# EAGLE design fuse-a-1 (EAGLE 9.6.2)
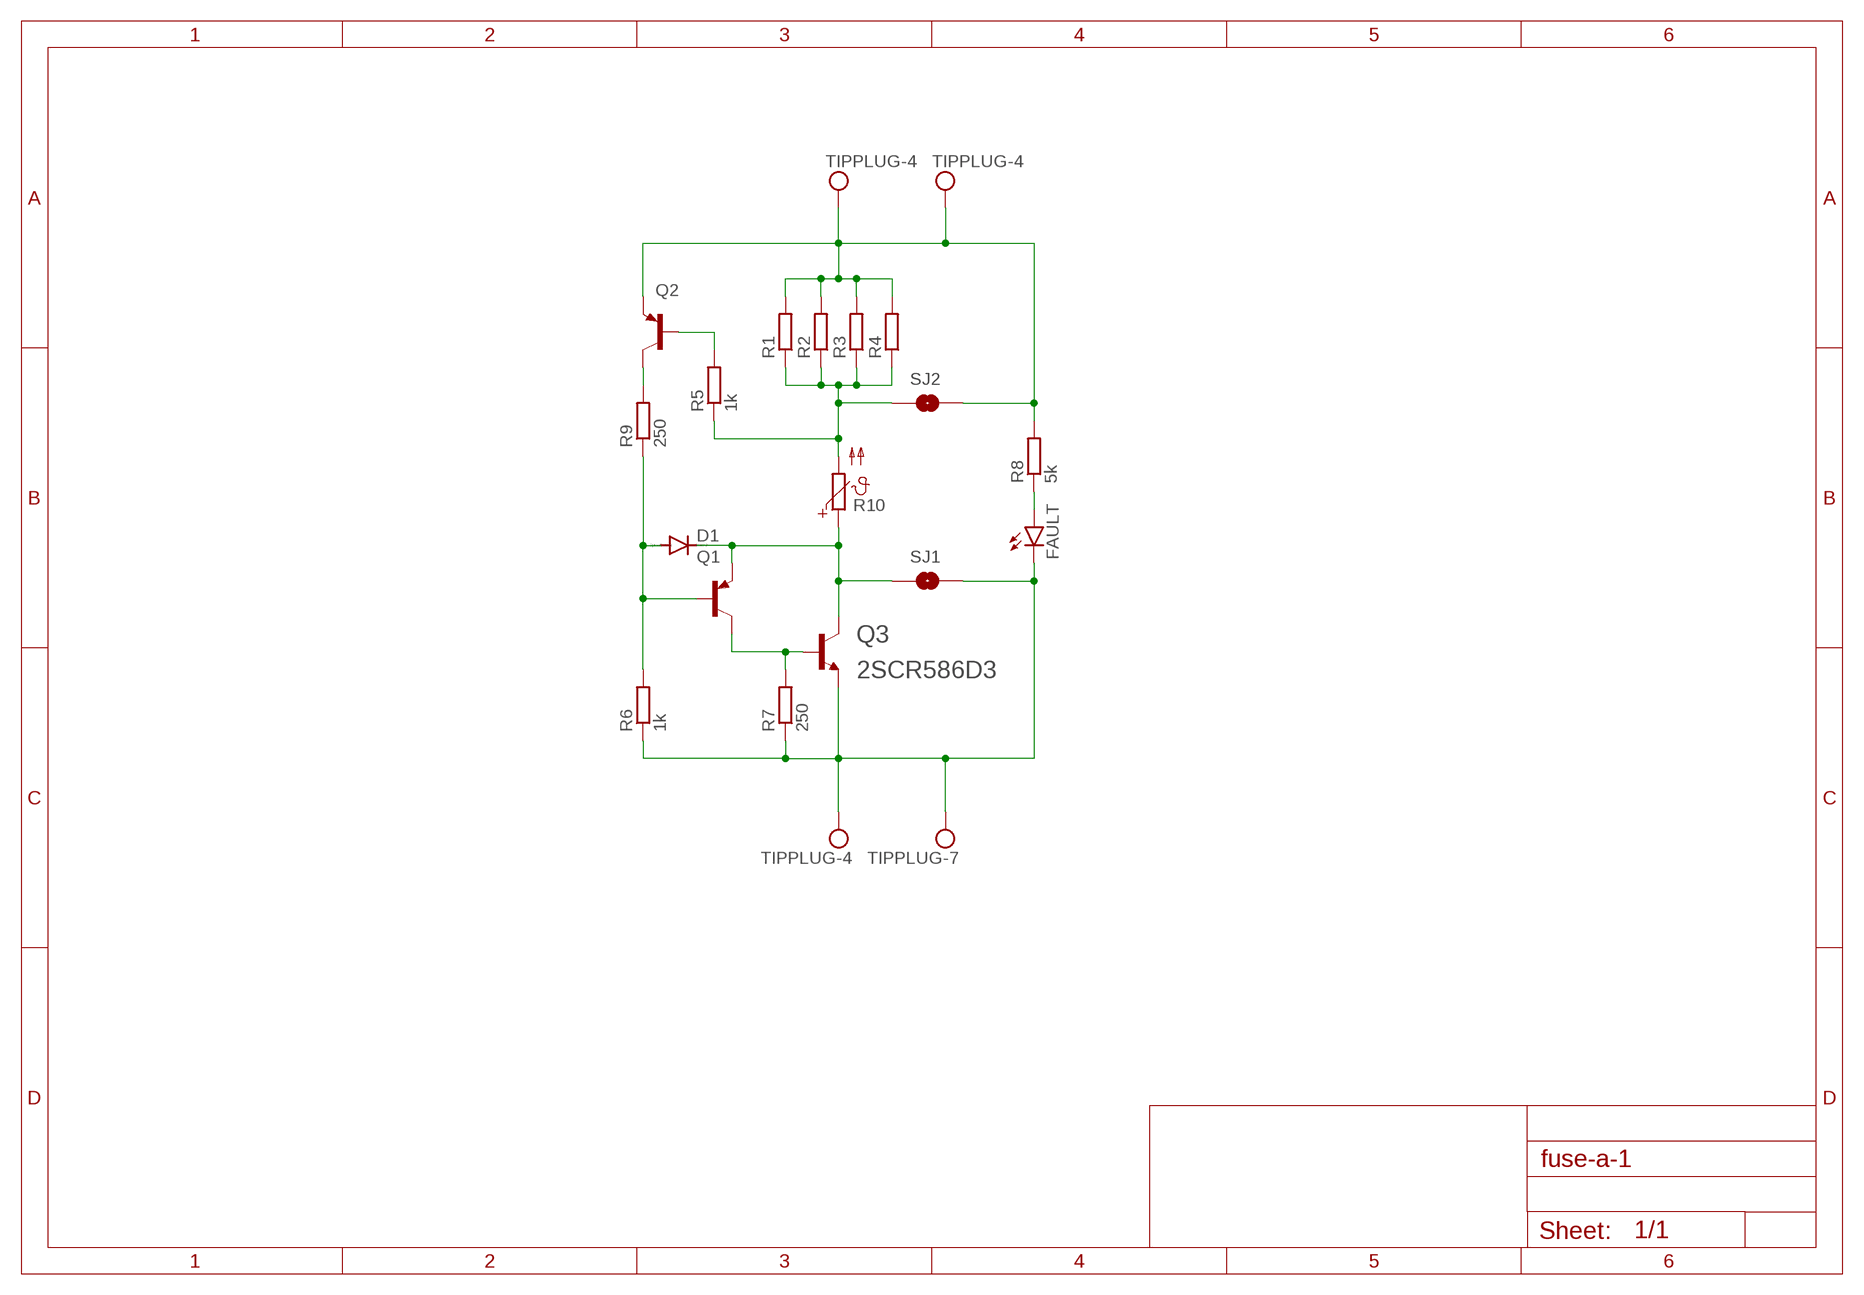
[diagram p0: schematic, sheet 1]

## Parts
D1  DIODE-MINIMELF  [MINIMELF]
FAULT  LEDCHIPLED_0603  [CHIPLED_0603]
Q1  BCX71SMD  [SOT23]
Q2  BCX71SMD  [SOT23]
Q3  2SCR586D3  2SCR586D3TL1  [D-PAK_TO252AA]
R1  R-EU_R2512  [R2512]
R2  R-EU_R2512  [R2512]
R3  R-EU_R2512  [R2512]
R4  R-EU_R2512  [R2512]
R5  1k  R-EU_R0805  [R0805]
R6  1k  R-EU_R0805  [R0805]
R7  250  R-EU_R0805  [R0805]
R8  5k  R-EU_R0805  [R0805]
R9  250  R-EU_R0805  [R0805]
R10  PTC_1812  [PTC1812]
SJ1  SJRND2  [SJ_RND2]
SJ2  SJRND2  [SJ_RND2]
U$1  TIPPLUG-4  [BANANAPLUG-4-LUG]
U$2  TIPPLUG-4  [BANANAPLUG-4-LUG]
U$3  TIPPLUG-7  [BANANAPLUG-7-LUG]
U$4  TIPPLUG-4  [BANANAPLUG-4-LUG]

## Nets
FUSEIN: R1.1 R2.1 R3.1 R4.1 R5.1 R10.2 SJ2.P$1
FUSEOUT: D1.C Q1.2(E) Q3.4(C) R10.1 SJ1.P$1
N$1: Q2.1(B) R5.2
N$4: D1.A Q1.1(B) R6.2 R9.1
N$5: Q1.3(C) Q3.1(B) R7.2
N$6: FAULT.A R8.1
N$8: Q2.3(C) R9.2
VIN: Q2.2(E) R1.2 R2.2 R3.2 R4.2 R8.2 SJ2.P$2 U$1.4MM($1) U$4.4MM($1)
VOUT: FAULT.C Q3.3(E) R6.1 R7.1 SJ1.P$2 U$2.4MM($1) U$3.7MM($1)

## Library data of the parts
D1 = diode:DIODE-: DIODE
FAULT = led:LED: LED OSRAM: - CHIPLED LG R971, LG N971, LY N971, LG Q971, LY Q971, LO R971, LY R971 LH N974, LH R974 LS Q976, LO Q976, LY Q976 LO Q996 - Hyper CHIPLED LW Q18S LB Q993, LB Q99A, LB R99A - SideLED LS A670, LO A670, LY A670, LG A670, LP A670 LB A673, LV A673, LT A673, LW A673 LH A674 LY A675 LS A676, LA A676, LO A676, LY A676, LW A676 LS A679, LY A679, LG A679 - Hyper Micro SIDELED® LS Y876, LA Y876, LO Y876, LY Y876 LT Y87S - SmartLED LW L88C, LW L88S LB L89C, LB L89S, LG L890 LS L89K, LO L89K, LY L89K LS L896, LA L896, LO L896, LY L896 - TOPLED LS T670, LO T670, LY T670, LG T670, LP T670 LSG T670, LSP T670, LSY T670, LOP T670, LYG T670 LG T671, LOG T671, LSG T671 LB T673, LV T673, LT T673, LW T673 LH T674 LS T676, LA T676, LO T676, LY T676, LB T676, LH T676, LSB T676, LW T676 LB T67C, LV T67C, LT T67C, LS T67K, LO T67K, LY T67K, LW E67C LS E67B, LA E67B, LO E67B, LY E67B, LB E67C, LV E67C, LT E67C LW T67C LS T679, LY T679, LG T679 LS T770, LO T770, LY T770, LG T770, LP T770 LB T773, LV T773, LT T773, LW T773 LH T774 LS E675, LA E675, LY E675, LS T675 LS T776, LA T776, LO T776, LY T776, LB T776 LHGB T686 LT T68C, LB T68C - Hyper Mini TOPLED® LB M676 - Mini TOPLED Santana® LG M470 LS M47K, LO M47K, LY M47K Source: http://www.osram.convergy.de LUXEON: - LUMILED® LXK2-PW12-R00, LXK2-PW12-S00, LXK2-PW14-U00, LXK2-PW14-V00 LXK2-PM12-R00, LXK2-PM12-S00, LXK2-PM14-U00 LXK2-PE12-Q00, LXK2-PE12-R00, LXK2-PE12-S00, LXK2-PE14-T00, LXK2-PE14-U00 LXK2-PB12-K00, LXK2-PB12-L00, LXK2-PB12-M00, LXK2-PB14-N00, LXK2-PB14-P00, LXK2-PB14-Q00 LXK2-PR12-L00, LXK2-PR12-M00, LXK2-PR14-Q00, LXK2-PR14-R00 LXK2-PD12-Q00, LXK2-PD12-R00, LXK2-PD12-S00 LXK2-PH12-R00, LXK2-PH12-S00 LXK2-PL12-P00, LXK2-PL12-Q00, LXK2-PL12-R00 Source: www.luxeon.com KINGBRIGHT: KA-3528ASYC Source: www.kingbright.com
Q1 Q2 = transistor-pnp:BCX71SMD: PNP Transistor
Q3 = eagleparts:2SCR586D3TL1
R1-R9 = rcl:R-EU_: RESISTOR, European symbol; SPICEPREFIX: R
R10 = tcs:PTC_: PHILIPS PTC
SJ1 SJ2 = eagleparts:SJ: SMD solder JUMPER
U$1-U$4 = eagleparts:TIPPLUG

## Board
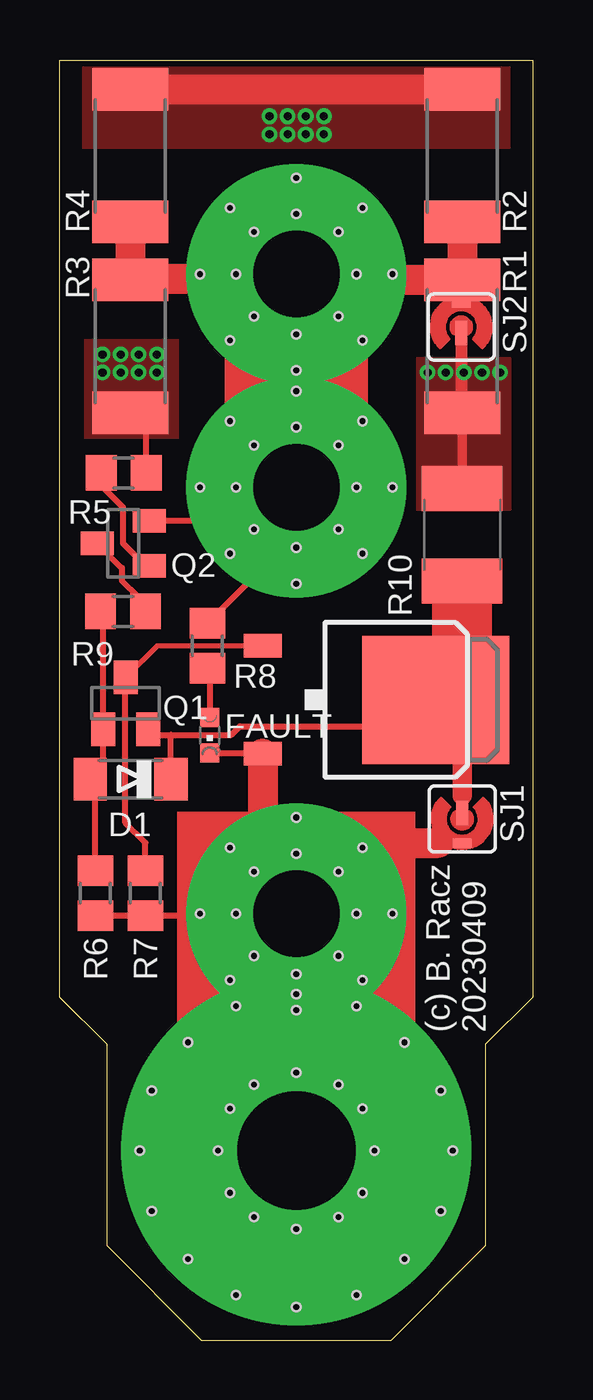
[diagram p1: board, top side]
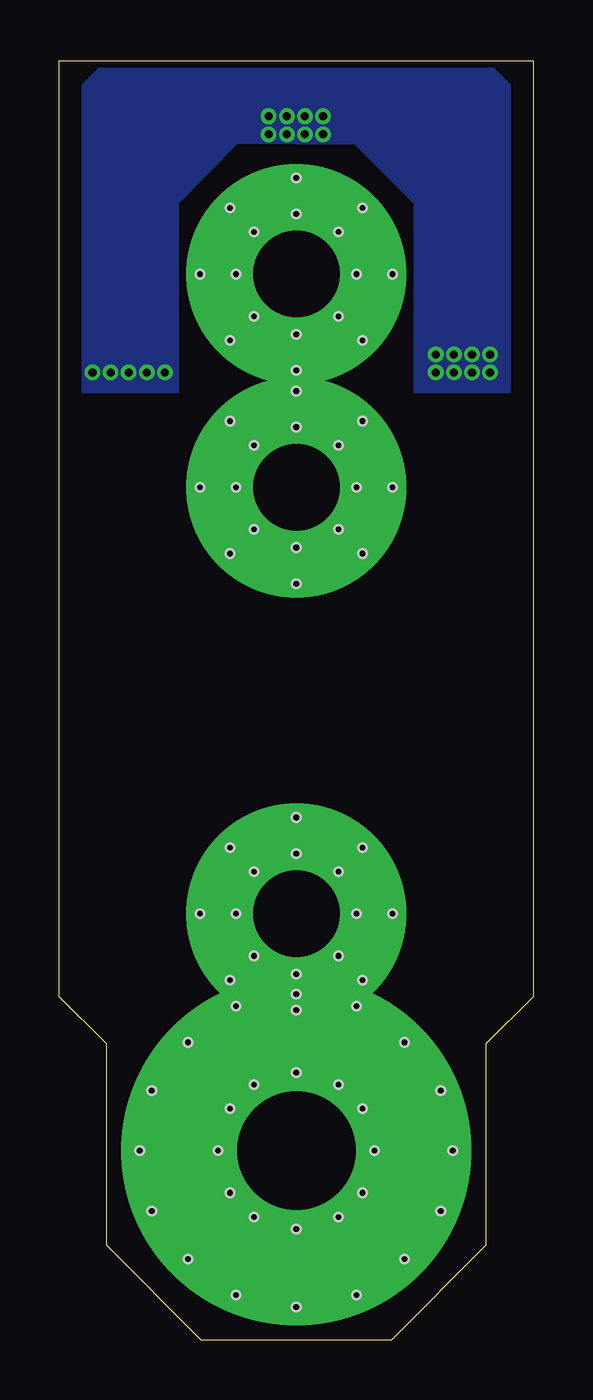
[diagram p2: board, bottom side, seen from below]

Size 20 x 54 mm. Coordinates in mm from the lower left corner, seen from the top.
Outline: 6,0 14,0 18,4 18,12.5 20,14.5 20,54 0,54 0,14.5 2,12.5 2,4 6,0
Copper layers (1*16): Top 0.035mm / dielectric 1.5mm / Bottom 0.035mm
Design rules "SeeedStudio_2layer_DRU_no_angle_20140221": minimum track width 6mil, minimum drill 12mil, track to track 6mil, track to pad 6mil, pad to pad 6mil, via to via 6mil, smd to smd 0mil, copper to edge 10mil, drill to drill 10mil, minimum pad ring 10mil, minimum via ring 6mil, stop-mask expansion 2mil, vias tented up to drill 100mil, thermal gap 10mil

### Footprints (pad centres in the part's own frame; a part is rotated, then mirrored left to right if it is on the bottom)
MINIMELF = smd 1.4 x 1.8: A 1.7,0; C -1.7,0
CHIPLED_0603 = smd 0.8 x 0.8: A 0,-0.75; C 0,0.75
SOT23 = smd 1 x 1.4: 1 -0.95,-1.1; 2 0.95,-1.1; 3 0,1.1
D-PAK_TO252AA = smd 1 x 1.6: 1 -2.28,-4.8; 3 2.28,-4.8 | smd 5.4 x 6.2: 4 0,2.5
R2512 = smd 1.8 x 3.2: 1 -2.8,0; 2 2.8,0
R0805 = smd 1.3 x 1.5: 1 -0.95,0; 2 0.95,0
PTC1812 = smd 1.9 x 3.4: 1 -1.95,0; 2 1.95,0
SJ_RND2 = smd 1.016 x 0.508: P$1 -0.254,0 | smd 0.406 x 0.813: P$2 1.016,0
BANANAPLUG-4-LUG = drill 3.65 pad 9.3: 4MM 0,0 | hole 0.35: 0,2.54; 0,-2.54; 2.54,0; -2.54,0; -1.778,1.778; 1.778,1.778; 1.778,-1.778; -1.778,-1.778; 0,4.064; 4.064,0; -4.064,0; 0,-4.064; 2.794,-2.794; -2.794,-2.794; -2.794,2.794; 2.794,2.794
BANANAPLUG-7-LUG = drill 5 pad 14.75: 7MM 0,0 | hole 0.35: 0,3.302; 0,-3.302; 3.302,0; -3.302,0; 1.778,2.794; 2.794,1.778; 2.794,-1.778; 1.778,-2.794; -1.778,-2.794; -2.794,-1.778; -2.794,1.778; -1.778,2.794; 0,6.604; 0,-6.604; 6.604,0; -6.604,0; 4.572,4.572; -4.572,-4.572; -4.572,4.572; 4.572,-4.572; 2.54,6.096; -2.54,6.096; -2.54,-6.096; 2.54,-6.096; 6.096,2.54; -6.096,2.54; -6.096,-2.54; 6.096,-2.54

### Placement (x,y rotation side)
D1  3.01,23.69 180 top
FAULT  6.35,25.54 180 top
Q1  2.8,26.89 0 top
Q2  2.7,33.64 90 top
Q3  13.38,27.03 270 top
R1  17,41.95 90 top
R2  17,50 270 top
R3  3,50 270 top
R4  3,41.95 90 top
R5  2.72,36.61 180 top
R6  1.53,18.87 90 top
R7  3.63,18.87 90 top
R8  6.25,29.31 90 top
R9  2.69,30.76 0 top
R10  17,34 90 top
SJ1  17,22 270 top
SJ2  16.96,42.77 90 top
U$1  10,36 90 top
U$2  10,18 270 top
U$3  10,8 90 top
U$4  10,45 270 top

### Tracks (layer width: path | path; a pad name or v marks a point on that pad's centre or on a via)
FUSEIN  (via drill 0.35)
  Top 0.254: R5.1 3.67,39.01 3.52,39.15 R4.1
  Top 0.406: R1.1 R10.2
  Top 0.508: SJ2.P$1 16.96,39.19 R1.1
  Top 1.27: R3.1 R2.1
  other vias: 15.54,40.84 16.31,40.84 17.07,40.84 17.83,40.84 18.59,40.84 8.88,50.9 9.64,50.9 10.4,50.9 11.16,50.9 8.88,51.67 9.64,51.67 10.4,51.67 11.16,51.67 1.83,40.84 2.59,40.84 3.35,40.84 4.11,40.84 4.11,41.61 3.35,41.61 2.59,41.61 1.83,41.61
  pour Top (no thermals): 15.09,35.05 19.05,35.05 19.05,41.45 15.09,41.45
  pour Top (no thermals): 19,50.33 19,54 1,54 1,50.33
  pour Bottom: 15,40 19,40 19,53 18.32,53.68 1.68,53.68 1,53 1,40 5,40 5,48 7.48,50.48 12.52,50.52 15,48
  pour Top (no thermals): 1.07,38.1 5.03,38.1 5.03,42.21 1.07,42.21
FUSEOUT
  Top 0.254: Q1.2 3.99,25.55 4.72,25.55 | 17,25.91 7.63,25.91 7.26,25.55 4.72,25.55 | D1.C 4.71,25.54 4.72,25.55
  Top 0.406: 17,31 R10.1
  Top 0.508: SJ1.P$1 17,23
  Top 0.813: 17,23 17,25.91 Q3.4
  Top 2.54: Q3.4 17,28.15 17,31
N$1
  Top 0.254: Q2.1 3.63,32.69 2.69,33.63 2.69,35.15 1.77,36.08 R5.2
N$4
  Top 0.254: R6.2 1.53,23.48 D1.A 1.31,23.92 1.85,24.46 Q1.1 1.85,30.65 R9.1
N$5
  Top 0.203: Q3.1 4.13,29.31 Q1.3
  Top 0.254: R7.2 3.63,21.01 2.79,21.84 2.79,27.98 Q1.3
N$6
  Top 0.254: R8.1 6.35,28.25 FAULT.A
N$8
  Top 0.254: Q2.3 2.64,32.6 2.64,32.05 3.3,31.39 3.35,31.39 3.64,31.11 R9.2
VIN
  Top 0.254: Q2.2 8.59,34.59 U$1.4MM 10,34.01 R8.2 | R1.2 17,43.83 SJ2.P$2
  Top 1.016: U$4.4MM 10,41.66
  Top 1.27: R2.2 R1.2 10,44.75 | R3.2 3,45.2 3.23,44.98 | 3.23,44.98 R4.2 | 3.23,44.98 3.4,44.8 10,44.8 10,44.75 | 10,44.75 10,41.66 U$1.4MM
VOUT
  Top 0.254: FAULT.C 8.54,24.79 Q3.3 | R6.1 R7.1 9.92,17.92 U$2.4MM
  Top 0.406: 16,21 16.98,21 SJ1.P$2
  Top 0.813: 8.58,19.42 U$2.4MM U$3.7MM
  Top 1.27: Q3.3 8.58,19.42 | U$2.4MM 13,21 16,21

### Text on the board
tNames: (c) B. Racz / 20230409